# Altium schematic sheet POWER_FPGA.SchDoc
size Tabloid; SheetNumber: 23; SheetTotal: 25; Sheet_Name: POWER; Size: 11x17
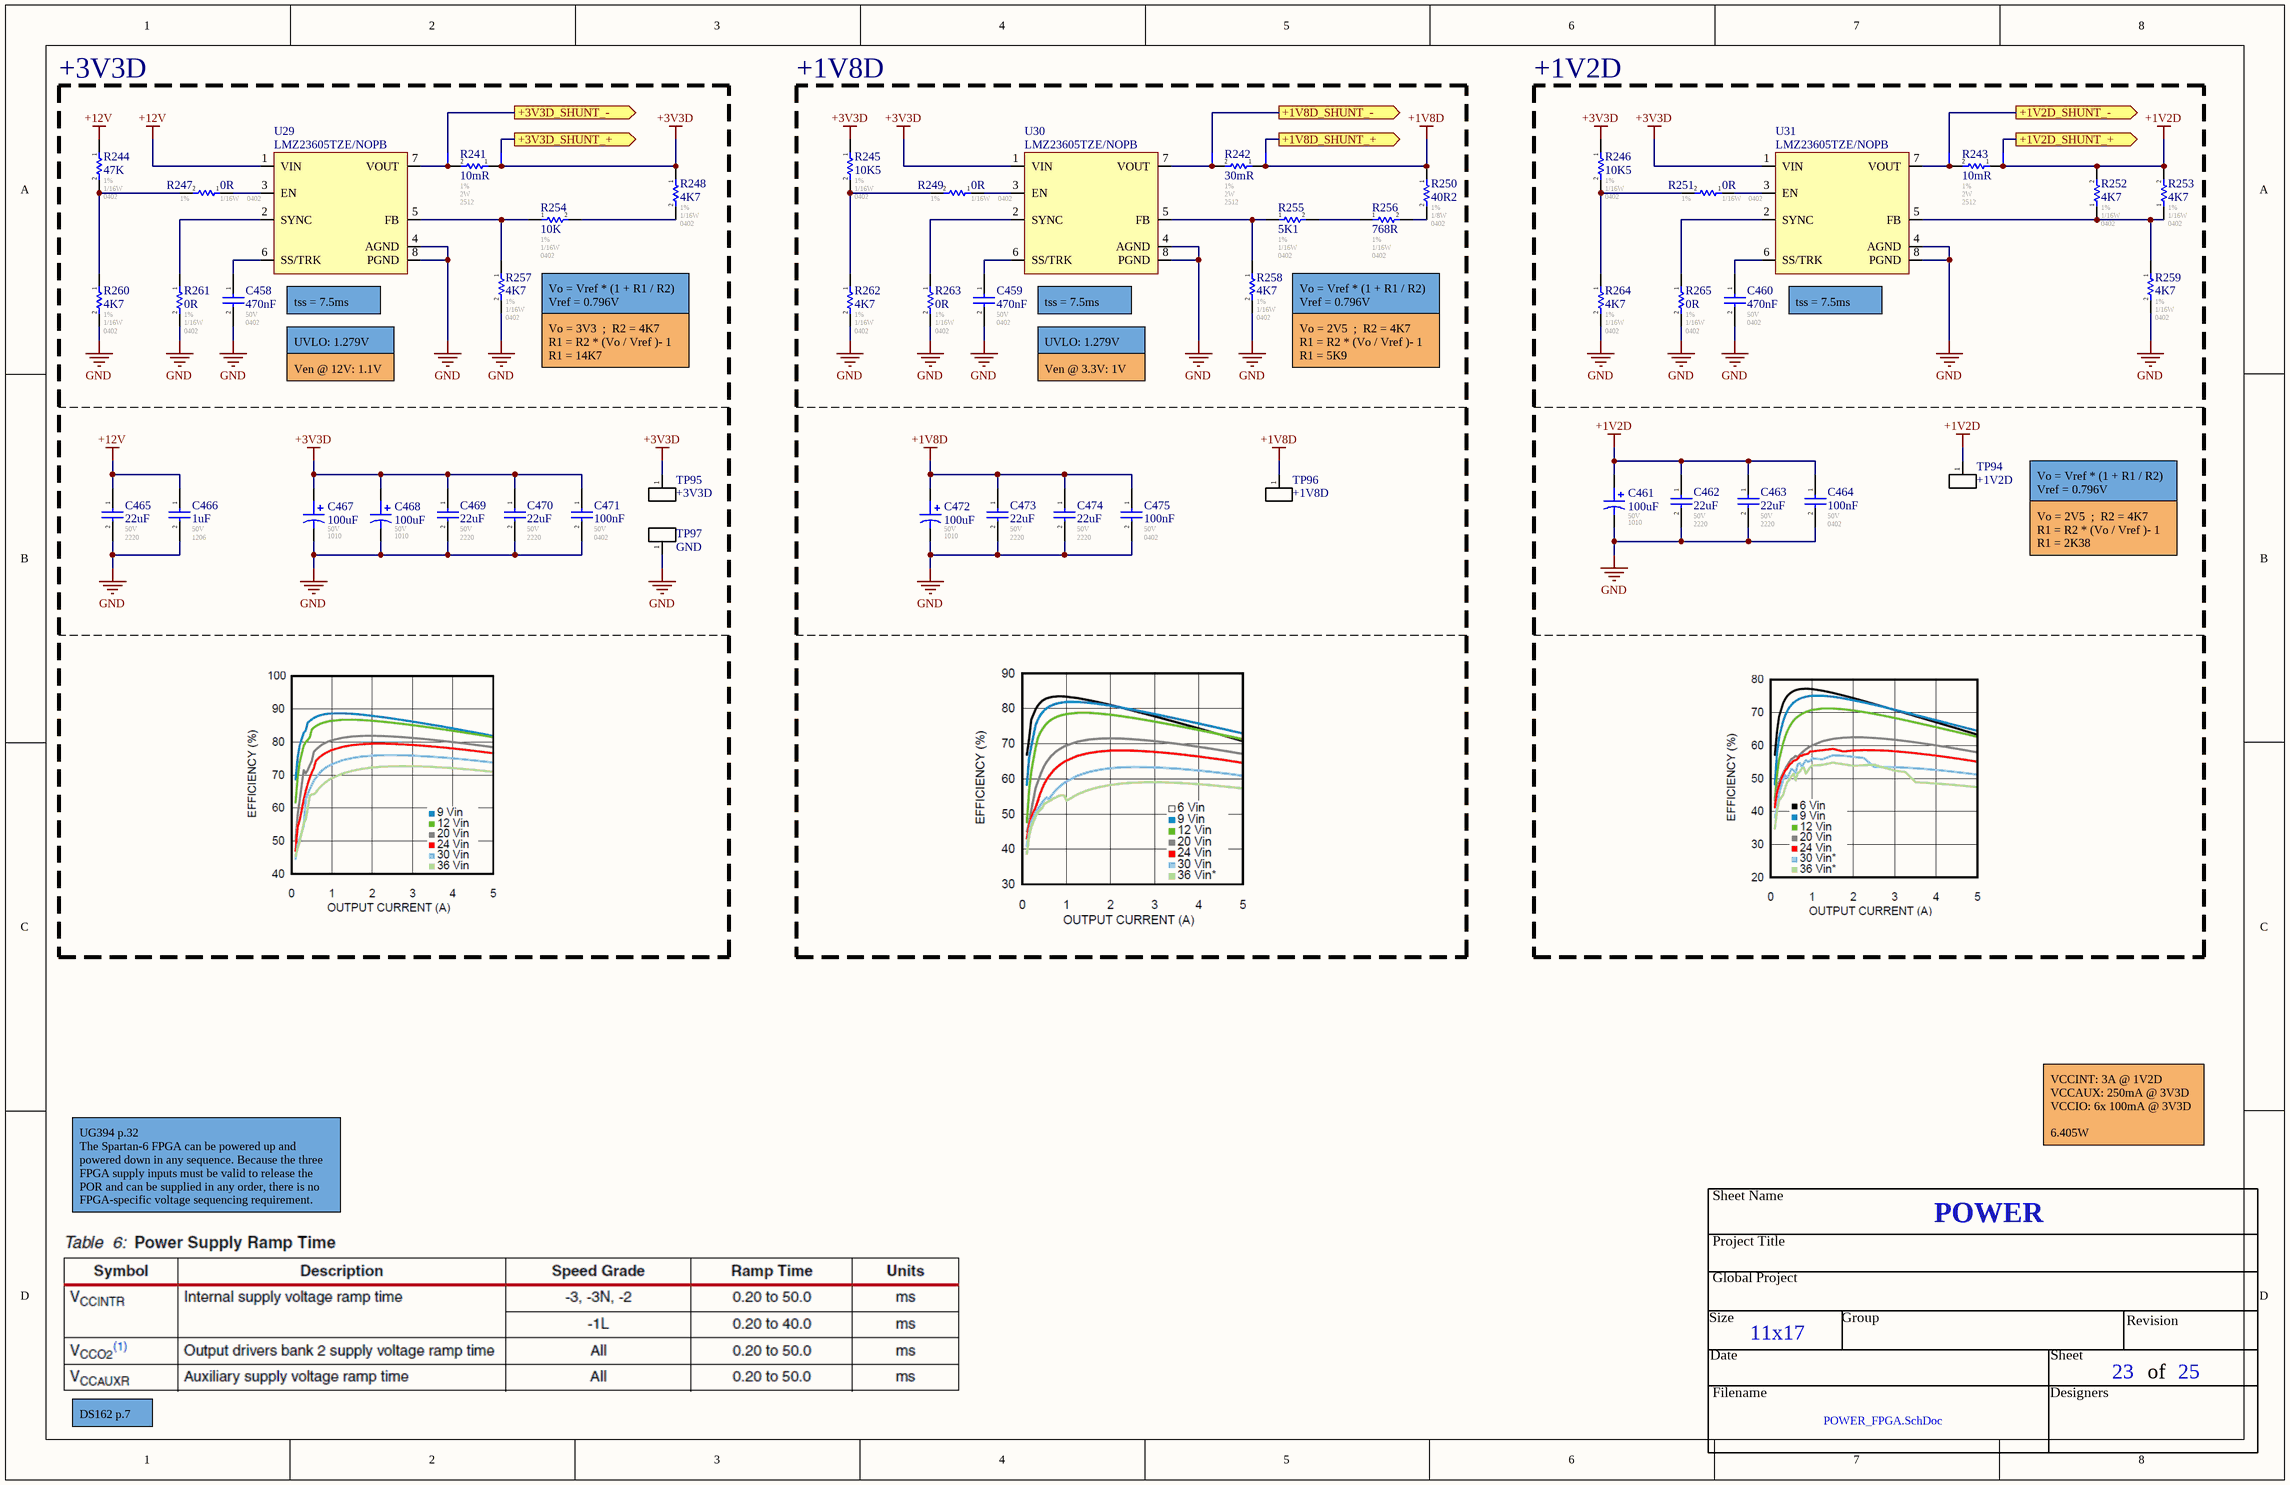
[diagram p0: POWER_FPGA.SchDoc]

## Parts
C458  470nF  Voltage - Rated: 50V  Footprint: 0402  [CAP_0402]
C459  470nF  Voltage - Rated: 50V  Footprint: 0402  [CAP_0402]
C460  470nF  Voltage - Rated: 50V  Footprint: 0402  [CAP_0402]
C461  value 100uF  Voltage: 50V  Package: 1010  [CAP_ALU_1010_vishay]  (hidden comment: MAL215099101E3)
C462  22uF  Voltage - Rated: 50V  Footprint: 2220  [CAP_2220]
C463  22uF  Voltage - Rated: 50V  Footprint: 2220  [CAP_2220]
C464  100nF  Voltage - Rated: 50V  Footprint: 0402  [CAP_0402]
C465  22uF  Voltage - Rated: 50V  Footprint: 2220  [CAP_2220]
C466  1uF  Voltage - Rated: 50V  Footprint: 1206  [CAP_1206]
C467  value 100uF  Voltage: 50V  Package: 1010  [CAP_ALU_1010_vishay]  (hidden comment: MAL215099101E3)
C468  value 100uF  Voltage: 50V  Package: 1010  [CAP_ALU_1010_vishay]  (hidden comment: MAL215099101E3)
C469  22uF  Voltage - Rated: 50V  Footprint: 2220  [CAP_2220]
C470  22uF  Voltage - Rated: 50V  Footprint: 2220  [CAP_2220]
C471  100nF  Voltage - Rated: 50V  Footprint: 0402  [CAP_0402]
C472  value 100uF  Voltage: 50V  Package: 1010  [CAP_ALU_1010_vishay]  (hidden comment: MAL215099101E3)
C473  22uF  Voltage - Rated: 50V  Footprint: 2220  [CAP_2220]
C474  22uF  Voltage - Rated: 50V  Footprint: 2220  [CAP_2220]
C475  100nF  Voltage - Rated: 50V  Footprint: 0402  [CAP_0402]
NT46  Net Tie  [NETTIE_5]  (value not drawn)  (net tie, no BOM)
NT47  Net Tie  [NETTIE_5]  (value not drawn)  (net tie, no BOM)
NT48  Net Tie  [NETTIE_5]  (value not drawn)  (net tie, no BOM)
NT49  Net Tie  [NETTIE_5]  (value not drawn)  (net tie, no BOM)
NT50  Net Tie  [NETTIE_5]  (value not drawn)  (net tie, no BOM)
NT51  Net Tie  [NETTIE_5]  (value not drawn)  (net tie, no BOM)
R241  10mR  Tolerance: 1%  Power: 2W  Package / Case: 2512  [RES_2512]
R242  30mR  Tolerance: 1%  Power: 2W  Package / Case: 2512  [RES_2512]
R243  10mR  Tolerance: 1%  Power: 2W  Package / Case: 2512  [RES_2512]
R244  47K  Tolerance: 1%  Power: 1/16W  Package / Case: 0402  [RES_0402]
R245  10K5  Tolerance: 1%  Power: 1/16W  Package / Case: 0402  [RES_0402]
R246  10K5  Tolerance: 1%  Power: 1/16W  Package / Case: 0402  [RES_0402]
R247  0R  Tolerance: 1%  Power: 1/16W  Package / Case: 0402  [RES_0402]
R248  4K7  Tolerance: 1%  Power: 1/16W  Package / Case: 0402  [RES_0402]
R249  0R  Tolerance: 1%  Power: 1/16W  Package / Case: 0402  [RES_0402]
R250  40R2  Tolerance: 1%  Power: 1/8W  Package / Case: 0402  [RES_0402]
R251  0R  Tolerance: 1%  Power: 1/16W  Package / Case: 0402  [RES_0402]
R252  4K7  Tolerance: 1%  Power: 1/16W  Package / Case: 0402  [RES_0402]
R253  4K7  Tolerance: 1%  Power: 1/16W  Package / Case: 0402  [RES_0402]
R254  10K  Tolerance: 1%  Power: 1/16W  Package / Case: 0402  [RES_0402]
R255  5K1  Tolerance: 1%  Power: 1/16W  Package / Case: 0402  [RES_0402]
R256  768R  Tolerance: 1%  Power: 1/16W  Package / Case: 0402  [RES_0402]
R257  4K7  Tolerance: 1%  Power: 1/16W  Package / Case: 0402  [RES_0402]
R258  4K7  Tolerance: 1%  Power: 1/16W  Package / Case: 0402  [RES_0402]
R259  4K7  Tolerance: 1%  Power: 1/16W  Package / Case: 0402  [RES_0402]
R260  4K7  Tolerance: 1%  Power: 1/16W  Package / Case: 0402  [RES_0402]
R261  0R  Tolerance: 1%  Power: 1/16W  Package / Case: 0402  [RES_0402]
R262  4K7  Tolerance: 1%  Power: 1/16W  Package / Case: 0402  [RES_0402]
R263  0R  Tolerance: 1%  Power: 1/16W  Package / Case: 0402  [RES_0402]
R264  4K7  Tolerance: 1%  Power: 1/16W  Package / Case: 0402  [RES_0402]
R265  0R  Tolerance: 1%  Power: 1/16W  Package / Case: 0402  [RES_0402]
TP94  +1V2D  [TP_HOLE]  (no BOM)
TP95  +3V3D  [TP_HOLE]  (no BOM)
TP96  +1V8D  [TP_HOLE]  (no BOM)
TP97  GND  [TP_HOLE]  (no BOM)
U29  LMZ23605TZE/NOPB  [REG_SWR_LMZ23605TZE/NOPB]
U30  LMZ23605TZE/NOPB  [REG_SWR_LMZ23605TZE/NOPB]
U31  LMZ23605TZE/NOPB  [REG_SWR_LMZ23605TZE/NOPB]

## Blocks framed on the sheet
+3V3D: C458 C465-C471 NT46 NT47 R241 R244 R247 R248 R254 R257 R260 R261 TP95 TP97 U29
+1V8D: C459 C472-C475 NT48 NT49 R242 R245 R249 R250 R255 R256 R258 R262 R263 TP96 U30
+1V2D: C460-C464 NT50 NT51 R243 R246 R251-R253 R259 R264 R265 TP94 U31

## Ports
+1V2D_SHUNT_+ (out), +1V2D_SHUNT_- (out), +1V8D_SHUNT_+ (out), +1V8D_SHUNT_- (out), +3V3D_SHUNT_+ (out), +3V3D_SHUNT_- (out)

## Nets
+1V2D: C461.1 C462.1 C463.1 C464.1 NT51.1 R243.1 R252.2 R253.2 TP94.1(A)
+1V8D: C472.1 C473.1 C474.1 C475.1 NT49.1 R242.1 R250.1 TP96.1(A)
+3V3D: C467.1 C468.1 C469.1 C470.1 C471.1 NT47.1 R241.1 R245.1 R246.1 R248.1 TP95.1(A) U30.1(VIN) U31.1(VIN)
+12V: C465.1 C466.1 R244.1 U29.1(VIN)
GND: C458.2 C459.2 C460.2 C461.2 C462.2 C463.2 C464.2 C465.2 C466.2 C467.2 C468.2 C469.2 C470.2 C471.2 C472.2 C473.2 C474.2 C475.2 R257.2 R258.2 R259.2 R260.2 R261.2 R262.2 R263.2 R264.2 R265.2 TP97.1(A) U29.4(AGND) U29.8(PGND) U30.4(AGND) U30.8(PGND) U31.4(AGND) U31.8(PGND)
+1V2D_SHUNT_+: NT51.2 ; port +1V2D_SHUNT_+
+1V2D_SHUNT_-: NT50.2 ; port +1V2D_SHUNT_-
+1V8D_SHUNT_+: NT49.2 ; port +1V8D_SHUNT_+
+1V8D_SHUNT_-: NT48.2 ; port +1V8D_SHUNT_-
+3V3D_SHUNT_+: NT47.2 ; port +3V3D_SHUNT_+
+3V3D_SHUNT_-: NT46.2 ; port +3V3D_SHUNT_-
NetC458_1: C458.1 U29.6(SS/TRK)
NetC459_1: C459.1 U30.6(SS/TRK)
NetC460_1: C460.1 U31.6(SS/TRK)
NetNT46_1: NT46.1 R241.2 U29.7(VOUT)
NetNT48_1: NT48.1 R242.2 U30.7(VOUT)
NetNT50_1: NT50.1 R243.2 U31.7(VOUT)
NetR244_2: R244.2 R247.2 R260.1
NetR245_2: R245.2 R249.2 R262.1
NetR246_2: R246.2 R251.2 R264.1
NetR247_1: R247.1 U29.3(EN)
NetR248_2: R248.2 R254.2
NetR249_1: R249.1 U30.3(EN)
NetR250_2: R250.2 R256.2
NetR251_1: R251.1 U31.3(EN)
NetR252_1: R252.1 R253.1 R259.1 U31.5(FB)
NetR254_1: R254.1 R257.1 U29.5(FB)
NetR255_1: R255.1 R258.1 U30.5(FB)
NetR255_2: R255.2 R256.1
NetR261_1: R261.1 U29.2(SYNC)
NetR263_1: R263.1 U30.2(SYNC)
NetR265_1: R265.1 U31.2(SYNC)

## Notes on the sheet
- (near U29) tss = 7.5ms
- UVLO: 1.279V
- Vo = Vref * (1 + R1 / R2)
  Vref = 0.796V
- (near R257) Vo = 3V3  ;  R2 = 4K7
  R1 = R2 * (Vo / Vref )- 1
  R1 = 14K7
- (near U30) tss = 7.5ms
- (near R258) Vo = 2V5  ;  R2 = 4K7
  R1 = R2 * (Vo / Vref )- 1
  R1 = 5K9
- (near U31) tss = 7.5ms
- Ven @ 12V: 1.1V
- Ven @ 3.3V: 1V
- Vo = 2V5  ;  R2 = 4K7
  R1 = R2 * (Vo / Vref )- 1
  R1 = 2K38
- VCCINT: 3A @ 1V2D
  VCCAUX: 250mA @ 3V3D
  VCCIO: 6x 100mA @ 3V3D
  6.405W
- UG394 p.32
  The Spartan-6 FPGA can be powered up and powered down in any sequence. Because the three FPGA supply inputs must be valid to release the POR and can be supplied in any order, there is no FPGA-specific voltage sequencing requirement.
- DS162 p.7
- Sheet Name
- Project Title
- Global Project
- Revision
- Size
- Date
- Group
- Sheet
- of
- Filename
- Designers

## Library data of the parts
C458-C460 = CAP_CER: CGA3E3X7R1H474K080AB / 0603 470nF 10% X7R Ceramic Capacitor; Mfr: TDK; Operating Temperature: -55C - 125C; Temperature Coefficient: X7R; ComponentLink1Description: Digikey; ComponentLink1URL: [Digikey Link]; Part#: CGA3E3X7R1H474K080AB; ComponentLink2Description: Datasheet; ComponentLink2URL: [Datasheet Link]; Tolerance: 10%; Ratings: AEC-Q200
C461 C467 C468 C472 = CAP_ALU_MAL215099101E3: CAP - ALU 100uF 20% 50V - 1010; Current: 490mA; Mfg: Vishay Dale; Mfg Part Number: MAL215099101E3; HelpURL: http://www.vishay.com/docs/28395/150crz.pdf; CreatedBy: Jonathan Bouchard; Temperature: -55°C to 125°C; Power: *; Supplier 1: Digikey; Supplier Part Number 1: 4399PHDKR-ND; Precision: 20%
C462 C463 C465 C469 C470 C473 C474 = CAP_CER: CGA9P3X7R1H226M250KB / 2220 22uF 20% X7R Ceramic Capacitor; Mfr: TDK; Operating Temperature: -55C - 125C; Temperature Coefficient: X7R; ComponentLink1Description: Digikey; ComponentLink1URL: https://www.digikey.ca/en/products/detail/tdk-corporation/CGA9P3X7R1H226M250KB/10240627; ComponentLink2Description: Datasheet; ComponentLink2URL: https://product.tdk.com/system/files/dam/doc/product/capacitor/ceramic/mlcc/charasheet/cga9p3x7r1h226m250kb.pdf; Tolerance: 20%; Ratings: AEC-Q200; Part#: CGA9P3X7R1H226M250KB; Supplier 1: Arrow Electronics; Supplier Part Number 1: CGA9P3X7R1H226M250KB; ComponentLink3Description: TDK; ComponentLink3URL: https://product.tdk.com/en/search/capacitor/ceramic/mlcc/info?part_no=CGA9P3X7R1H226M250KB; ComponentLink4Description: Octopart; ComponentLink4URL: https://octopart.com/cga9p3x7r1h226m250kb-tdk-102764996?r=sp
C464 C471 C475 = CAP_CER: GCM155R71H104KE02J / 0402 100nF 10% X7R Ceramic Capacitor; Mfr: Murata; Operating Temperature: -55C - 125C; Temperature Coefficient: X7R; ComponentLink1Description: Digikey; ComponentLink1URL: [Digikey Link]; Part#: GCM155R71H104KE02J; ComponentLink2Description: Datasheet; ComponentLink2URL: [Datasheet Link]; Tolerance: 10%; Ratings: AEC-Q200
C466 = CAP_CER: GCJ31CR71H105KA12L / 1206 1uF 10% X7R Ceramic Capacitor; Mfr: Murata; Operating Temperature: -55C - 125C; Temperature Coefficient: X7R; ComponentLink1Description: Digikey; ComponentLink1URL: [Digikey Link]; Part#: GCJ31CR71H105KA12L; ComponentLink2Description: Datasheet; ComponentLink2URL: [Datasheet Link]; Tolerance: 10%; Ratings: AEC-Q200
NT46-NT51 = NET_TIE_SMALL
R241 R243 = RESISTOR: CSRN2512FK10L0; Automotive: AEC-Q200; Operating Temperature: -55C - 155C; ComponentLink1Description: Digikey; ComponentLink1URL: https://www.digikey.ca/fr/products/detail/stackpole-electronics-inc/CSRN2512FK10L0/1646104; Part #: CSRN2512FK10L0
R242 = RESISTOR: CSRN2512FK30L0; Automotive: AEC-Q200; Operating Temperature: -55C - 155C; ComponentLink1Description: Digikey; ComponentLink1URL: https://www.digikey.ca/fr/products/detail/stackpole-electronics-inc/CSRN2512FK30L0/1646107; Part #: CSRN2512FK30L0
R244-R265 = RESISTOR: Automotive: AEC-Q200; Operating Temperature: *; # Digikey: *; ComponentLink1Description: Digikey; ComponentLink1URL: *; # Manufacturer: *
TP94-TP97 = TESTPOINT: Test Point; ClassName: Testpoint
U29-U31 = REG_SWR_LMZ23605TZE/NOPB: REG - IC BUCK SYNC 36V 5A - TO-PMOD-7; Manufacturer #1: Texas Instruments; Value: 0.8 ~ 6 V; Voltage Rating: 6 ~ 36 V; GRAMS Lib Spec: 2.8; Note: One Reflow; Magnetic Material: YES; Cryo: UNKNOWN; Tolerance: *; Current Rating: 5A; Power Max: *; HelpURL: http://www.ti.com/lit/ds/symlink/lmz23605.pdf; CreatedBy/Date: Arnaud Samson - 05/07/18; VerifiedBy: Jonathan Bouchard 2018-07-13; Temperature: -40°C ~ 125°C; Package: TO-PMOD-7; Manufacturer #2: *; Assembly Type: SMD; Part Number #2: *; Part Number #1: LMZ23605TZE/NOPB; Polarized: YES; Supplier 1: Digi-Key; Supplier Part Number 1: 296-35357-1-ND